# EAGLE design Carregador de Bateria (EAGLE 5.10)
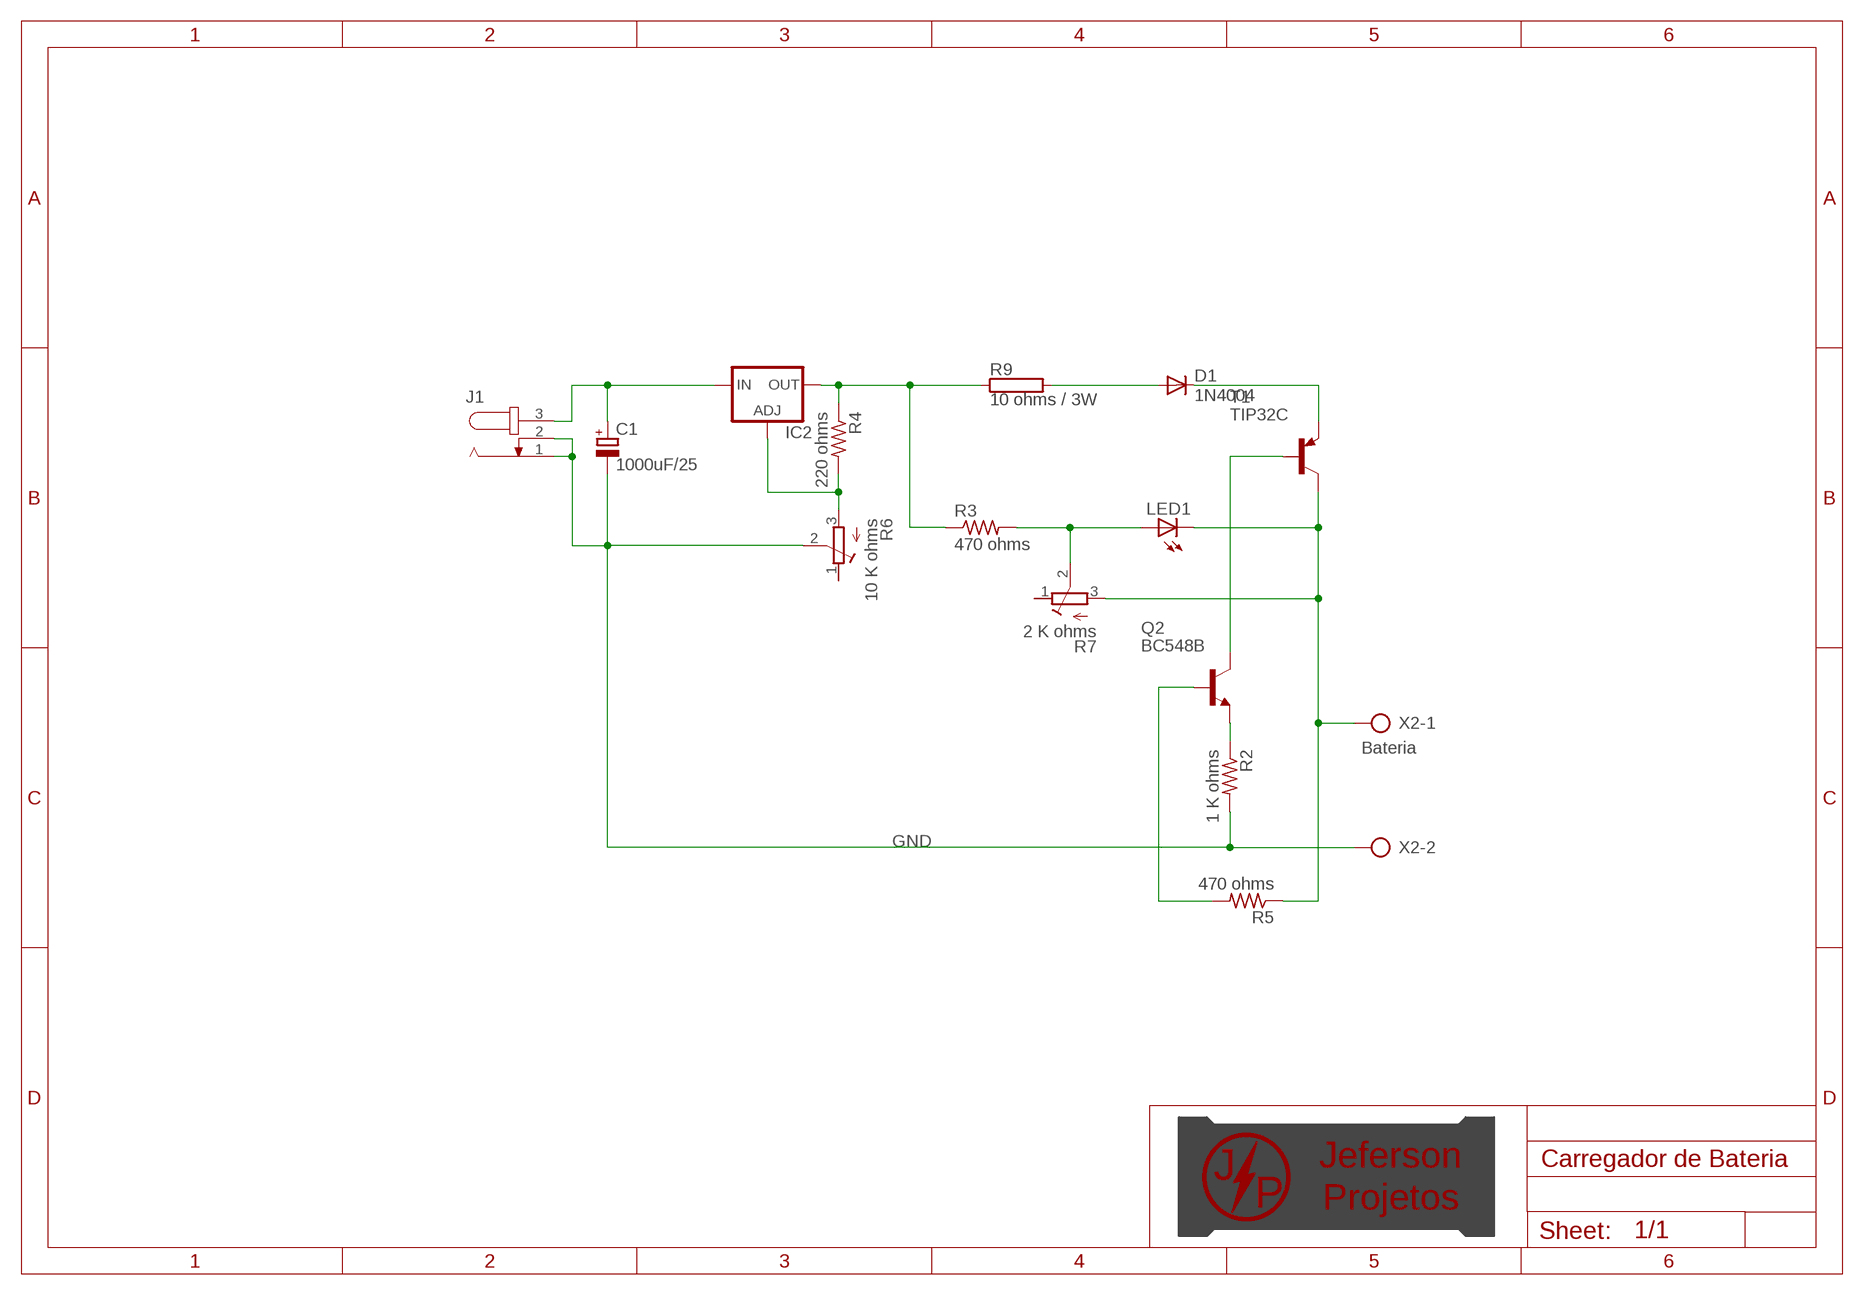
[diagram p0: schematic, sheet 1]

## Parts
C1  1000uF/25  CPOL-EUE7.5-16  [E7,5-16]
D1  1N4004  [DO41-10]
IC2  LM317TS  [317TS]
J1  JACK-PLUG0  [SPC4077]
LED1  LED5MM  [LED5MM]
Q2  BC548B  [TO92-EBC]
R2  1 K ohms  R-US_0207/7  [0207/7]
R3  470 ohms  R-US_0207/7  [0207/7]
R4  220 ohms  R-US_0207/7  [0207/7]
R5  470 ohms  R-US_0207/7  [0207/7]
R6  10 K ohms  R-TRIMM3006P  [RTRIM3006P]
R7  2 K ohms  R-TRIMM3006P  [RTRIM3006P]
R9  10 ohms / 3W  RRWM5X26  [RWM5X26]
T1  TIP32C  [TO220V]
U$1  LOG_FULL'BOTTOM'  [LOG_B]
X2  Bateria  SMKDSP_1,5/2  [SMKDSP_1,5/2]

## Nets
GND: C1.- J1.1 J1.2 R2.2 R6.2(S) X2.2
N$1: C1.+ IC2.3(IN) J1.3
N$3: D1.A R9.2
N$4: LED1.A R3.2 R7.2(S)
N$5: D1.C T1.3(E)
N$6: Q2.C T1.1(B)
N$7: Q2.E R2.1
N$38: Q2.B R5.2
N$39: IC2.2(OUT) R3.1 R4.1 R9.1
N$40: IC2.1(ADJ) R4.2 R6.3(E)
VCC/BAT: LED1.K(C) R5.1 R7.3(E) T1.2(C) X2.1
Unconnected: R6.1(A) R7.1(A)

## Library data of the parts
C1 = resistor:CPOL-EU: POLARIZED CAPACITOR, European symbol
D1 = diode:1N4004: DIODE general purpose rectifier, 1 A
IC2 = v-reg:LM317TS: VOLTAGE REGULATOR
J1 = con-jack:JACK-PLUG: DC POWER JACK Power Jack, DC, Right Angle, Through Hole, Rated 5A at 16VDC, PC Terminals Distributor: Farnell (www.Farnell.de) Drawing: 84N1161.pdf / 84N1162.pdf Manufacturer: SPC Technology (www.spctechnology.com) Type: SPC4077 / SPC 4078
LED1 = led:LED: LED OSRAM: - CHIPLED LG R971, LG N971, LY N971, LG Q971, LY Q971, LO R971, LY R971 LH N974, LH R974 LS Q976, LO Q976, LY Q976 LO Q996 - Hyper CHIPLED LW Q18S LB Q993, LB Q99A, LB R99A - SideLED LS A670, LO A670, LY A670, LG A670, LP A670 LB A673, LV A673, LT A673, LW A673 LH A674 LY A675 LS A676, LA A676, LO A676, LY A676, LW A676 LS A679, LY A679, LG A679 - Hyper Micro SIDELED® LS Y876, LA Y876, LO Y876, LY Y876 LT Y87S - SmartLED LW L88C, LW L88S LB L89C, LB L89S, LG L890 LS L89K, LO L89K, LY L89K LS L896, LA L896, LO L896, LY L896 - TOPLED LS T670, LO T670, LY T670, LG T670, LP T670 LSG T670, LSP T670, LSY T670, LOP T670, LYG T670 LG T671, LOG T671, LSG T671 LB T673, LV T673, LT T673, LW T673 LH T674 LS T676, LA T676, LO T676, LY T676, LB T676, LH T676, LSB T676, LW T676 LB T67C, LV T67C, LT T67C, LS T67K, LO T67K, LY T67K, LW E67C LS E67B, LA E67B, LO E67B, LY E67B, LB E67C, LV E67C, LT E67C LW T67C LS T679, LY T679, LG T679 LS T770, LO T770, LY T770, LG T770, LP T770 LB T773, LV T773, LT T773, LW T773 LH T774 LS E675, LA E675, LY E675, LS T675 LS T776, LA T776, LO T776, LY T776, LB T776 LHGB T686 LT T68C, LB T68C - Hyper Mini TOPLED® LB M676 - Mini TOPLED Santana® LG M470 LS M47K, LO M47K, LY M47K Source: http://www.osram.convergy.de LUXEON: - LUMILED® LXK2-PW12-R00, LXK2-PW12-S00, LXK2-PW14-U00, LXK2-PW14-V00 LXK2-PM12-R00, LXK2-PM12-S00, LXK2-PM14-U00 LXK2-PE12-Q00, LXK2-PE12-R00, LXK2-PE12-S00, LXK2-PE14-T00, LXK2-PE14-U00 LXK2-PB12-K00, LXK2-PB12-L00, LXK2-PB12-M00, LXK2-PB14-N00, LXK2-PB14-P00, LXK2-PB14-Q00 LXK2-PR12-L00, LXK2-PR12-M00, LXK2-PR14-Q00, LXK2-PR14-R00 LXK2-PD12-Q00, LXK2-PD12-R00, LXK2-PD12-S00 LXK2-PH12-R00, LXK2-PH12-S00 LXK2-PL12-P00, LXK2-PL12-Q00, LXK2-PL12-R00 Source: www.luxeon.com KINGBRIGHT: KA-3528ASYC Source: www.kingbright.com
Q2 = transistor-npn:BC548*: NPN Transistor
R2-R5 = resistor:R-US_: RESISTOR, American symbol
R6 R7 = resistor:R-TRIMM: Trimm resistor
R9 = resistor-power:R: Power Resitor
T1 = transistor:TIP32: PNP Transistor Medium Power Linear Switching Applications Source: http://onsemi.com
U$1 = Logomarca:LOG_FULL: Logomarca dos projetos de Jeferson
X2 = con-phoenix-smkdsp:SMKDSP_1,5/2: Printklemme, Nennstrom: 17,5 A, Bemessungsspannung: 250 V, Raster: 5,0 mm Source: http://eshop.phoenixcontact.de .. 1733415.pdf

## Board
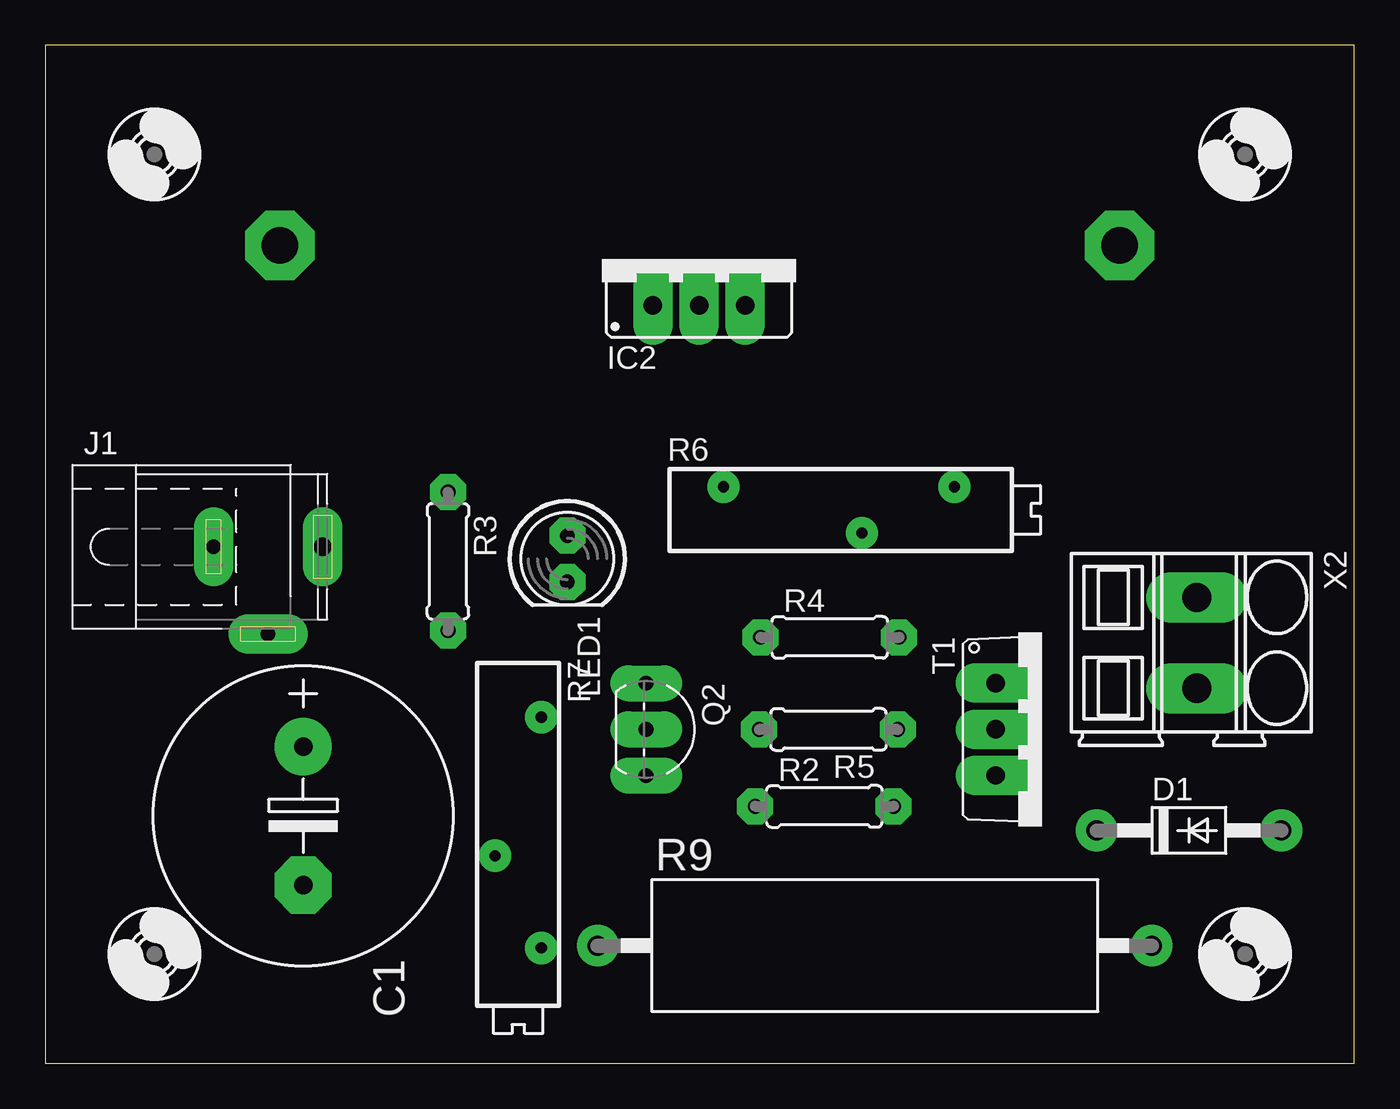
[diagram p1: board, top side]
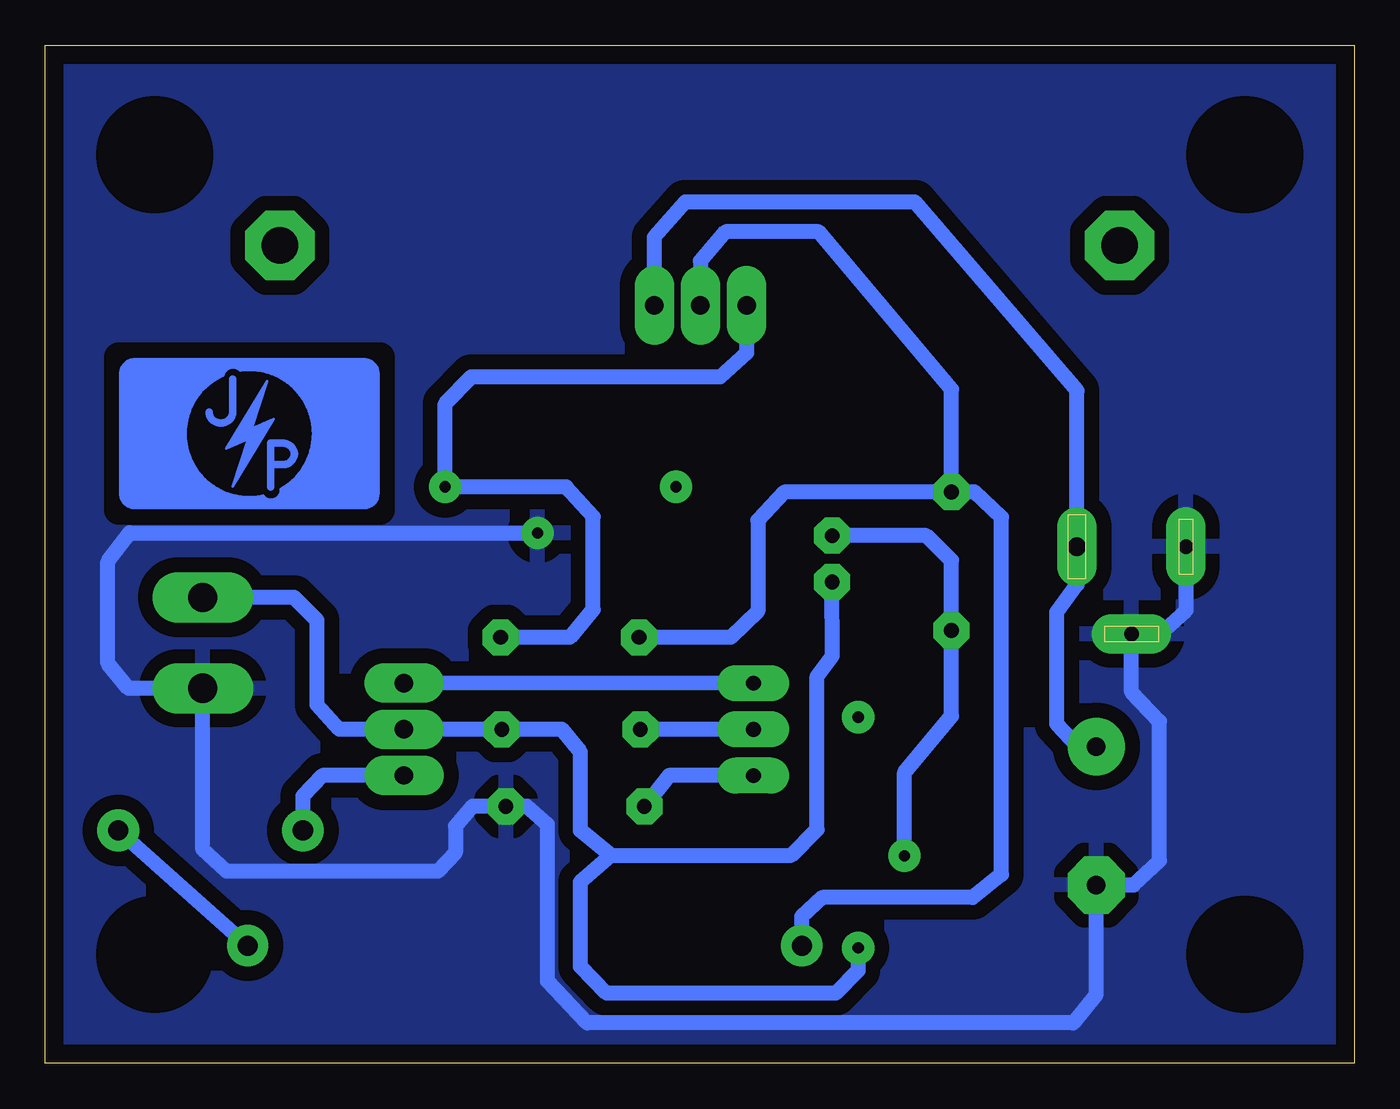
[diagram p2: board, bottom side, seen from below]

Size 72 x 56 mm. Coordinates in mm from the lower left corner, seen from the top.
Outline: 0,0 72,0 72,56 0,56 0,0
Copper layers (1*16): Top 0.035mm / dielectric 1.5mm / Bottom 0.035mm
Design rules "default *": minimum track width 32mil, minimum drill 24mil, track to track 8mil, track to pad 8mil, pad to pad 8mil, via to via 8mil, smd to smd 8mil, copper to edge 40mil, drill to drill 8mil, minimum pad ring 23mil, minimum via ring 8mil, stop-mask expansion 4mil, vias tented up to drill 0mil, thermal gap 30mil

### Footprints (pad centres in the part's own frame; a part is rotated, then mirrored left to right if it is on the bottom)
E7,5-16 = drill 1.016 pad 3.15 round: + -3.81,0 | drill 1.016 pad 3.15 octagon: - 3.81,0
DO41-10 = drill 1.118 round: A 5.08,0; C -5.08,0
317TS = drill 1.016 long: 1 -2.54,-2.54; 2 0,-2.54; 3 2.54,-2.54
SPC4077 = drill 0.8 pad 2.184 long: 1 -3,0; 2 0,-4.8 | drill 1 pad 2.184 long: 3 3,0
LED5MM = drill 0.813 octagon: A -1.27,0; K 1.27,0
TO92-EBC = drill 0.813 long: B 0,-1.27; C -2.54,-1.27; E 2.54,-1.27
0207/7 = drill 0.813 octagon: 1 -3.81,0; 2 3.81,0
RTRIM3006P = drill 0.61 round: 1 -7.62,1.27; 2 0,-1.27; 3 5.08,1.27
RWM5X26 = drill 1.1 pad 2 round: 1 -15.24,0; 2 15.24,0
TO220V = drill 1.016 long: 1 -2.54,-2.54; 2 0,-2.54; 3 2.54,-2.54
SMKDSP_1,5/2 = drill 1.6 pad 1.8 long: 1 -2.5,0; 2 2.5,0

### Placement (x,y rotation side)
C1  14.18,13.61 270 top
D1  62.92,12.81 0 top
IC2  35.96,44.24 0 top
J1  12.25,28.42 0 top
LED1  28.71,27.75 270 top
Q2  34.32,18.36 270 top
R2  42.86,14.13 0 top
R3  22.15,27.62 270 top
R4  43.15,23.43 0 top
R5  43.08,18.36 180 top
R6  44.93,30.44 0 top
R7  26.01,11.42 270 top
R9  45.63,6.47 0 top
T1  54.81,18.37 270 top
U$1  60.78,34.64 0 top
U$3  [2,8-PAD]  6,6 0 top
U$4  [2,8-PAD]  66,6 0 top
U$5  [2,8-PAD]  6,50 0 top
U$6  [2,8-PAD]  66,50 0 top
X2  63.34,23.13 270 top

### Tracks (layer width: path | path; a pad name or v marks a point on that pad's centre or on a via)
GND
  Bottom 0.813: R6.2 67.37,29.17 68.56,27.59 68.57,22 67.44,20.63 X2.2 63.34,11.76 62.04,10.56 50.41,10.56 49.44,11.6 49.44,13.03 48.5,14.13 R2.2 45.51,14.13 44.38,13.14 44.38,4.52 42.19,2.21 15.46,2.21 14.18,3.78 C1.- 12.14,9.8 10.71,11.14 10.71,18.81 12.25,20.44 J1.2 10.65,23.61 9.24,24.92 J1.1
  pour Bottom (isolate 0.813): 0,0 73.66,0 73.66,55.88 0,55.88
N$1
  Bottom 0.813: C1.+ 15.2,17.42 16.36,18.67 16.36,24.82 15.24,26.34 J1.3 15.25,37.01 24.18,47.38 36.8,47.38 38.51,45.44 IC2.3
N$2  (via drill 2 pad 3.81)
  other vias: 12.9,45
N$3
  Bottom 0.813: R9.2 D1.A
N$4
  Bottom 0.813: LED1.A 23.54,29.03 22.15,27.66 R3.2 22.15,19.1 24.73,16.01 R7.2
N$5
  Bottom 0.813: T1.3 56.77,15.83 57.85,14.71 D1.C
N$6
  Bottom 0.813: Q2.C T1.1
N$7
  Bottom 0.813: Q2.E 37.7,15.82 R2.1
N$8  (via drill 2 pad 3.81)
  other vias: 59.1,45
N$38
  Bottom 0.813: Q2.B R5.2
N$39
  Bottom 0.813: R9.1 30.4,8.06 29.26,9.12 20.98,9.12 19.4,10.38 19.4,30.03 20.9,31.43 R3.1 | IC2.2 35.97,44.14 34.58,45.75 29.46,45.75 22.15,37.07 R3.1 | R4.1 34.28,23.43 32.8,24.86 32.8,29.88 31.36,31.43 R3.1
N$40
  Bottom 0.813: R4.2 43.14,23.43 41.87,24.95 41.86,30.07 43.34,31.71 R6.3 50.01,36.28 48.56,37.77 34.86,37.77 33.41,39.09 IC2.1
VCC/BAT
  Bottom 0.813: X2.1 58.33,25.64 57.06,24.37 57.06,19.72 55.83,18.37 T1.2 R5.1 43.58,18.36 42.57,17.13 42.57,12.8 40.89,11.42 | 40.89,11.42 30.96,11.45 29.54,12.85 29.54,21.29 28.71,22.41 LED1.K | R7.3 27.29,5.1 28.53,3.85 41.12,3.85 42.57,5.32 42.57,9.97 40.89,11.42